# Altium schematic sheet Esq_Referencia_Fte_Simple.SchDoc: Referencia Fuente Simple Vcc/2
size A4; Date: 04/2014; Author: Roux, Federico G.; CompanyName: Universidad Favaloro; DrawnBy: Roux, Federico G.; Engineer: Dr. Craiem, Damian; Organization: Universidad Favaloro; DocumentName: Esq_Referencia_Fte_Simple; ProjectName: Acondicionamiento_Presion
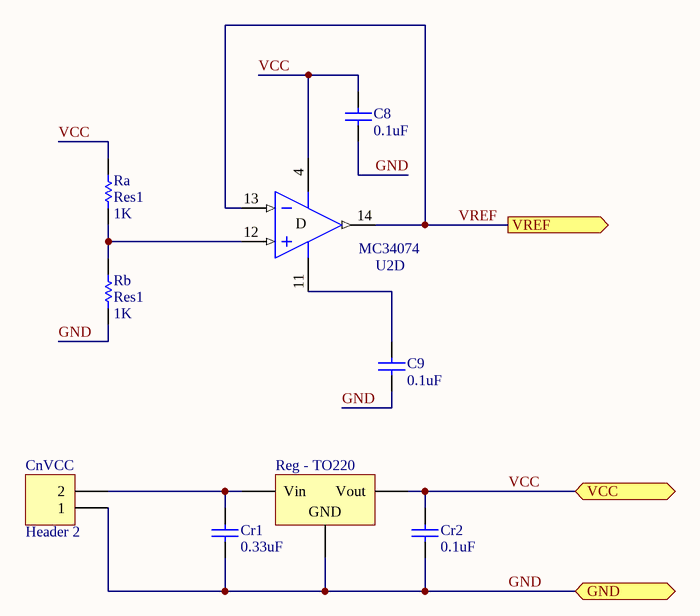
[diagram p0: Esq_Referencia_Fte_Simple.SchDoc]

## Parts
C8  value 0.1uF  [6-0805_M]  (hidden comment: Cap)
C9  value 0.1uF  [6-0805_M]  (hidden comment: Cap)
CnVCC  Header 2  [HDR1X2]
Cr1  value 0.33uF  [6-0805_M]  (hidden comment: Cap)
Cr2  value 0.1uF  [6-0805_M]  (hidden comment: Cap)
Ra  Res1  value 1K  [6-0805_L]
Rb  Res1  value 1K  [6-0805_L]
Reg_-_TO220  Volt Reg  [TO-220-AB]  (value not drawn)
U2  MC34074  [Q-14]  (part D of 4)

## Ports
GND, VCC, VREF (out)

## Nets
GND: C8.2 C9.2 CnVCC.1 Cr1.2 Cr2.2 Rb.1 Reg_-_TO220.2(GND) ; port GND
VCC: C8.1 Cr2.1 Ra.2 Reg_-_TO220.3(Vout) U2.4(V+) ; port VCC
VREF: U2.13(IN-) U2.14(OUT) ; port VREF
NetC9_1: C9.1 U2.11(V-)
NetCnVCC_2: CnVCC.2 Cr1.1 Reg_-_TO220.1(Vin)
NetRa_1: Ra.1 Rb.2 U2.12(IN+)

## Notes on the sheet
- (in symbol AD713BQ, part D) D

## Library data of the parts
C8 C9 Cr1 Cr2 = Cap: Capacitor; Published: 8-Jun-2000; LatestRevisionDate: 17-Jul-2002; LatestRevisionNote: Re-released for DXP Platform.; PackageReference: RAD-0.3; Publisher: Altium Limited; PackageDescription: Radial Cap, Thru-Hole; 2 Leads; 0.3 in Pin Spacing
CnVCC = Header 2: Header, 2-Pin; LatestRevisionDate: 17-Jul-2002; LatestRevisionNote: Re-released for DXP Platform.; Publisher: Altium Limited
Ra Rb = Res1: Resistor; Published: 8-Jun-2000; LatestRevisionDate: 17-Jul-2002; LatestRevisionNote: Re-released for DXP Platform.; PackageReference: AXIAL-0.3; Publisher: Altium Limited; PackageDescription: Axial Device, Thru-Hole; 2 Leads; 0.3 in Pin Spacing
Reg_-_TO220 = Volt Reg: Voltage Regulator; Published: 24-Mar-1999; LatestRevisionDate: 29-May-2009; LatestRevisionNote: IPC-7351 Footprint Added.; PackageReference: D2PAK; Publisher: Altium Limited; PackageDescription: 3-Pin Transistor Outline Package 2.54 mm Pitch, 15.1 mm Lead Span
U2 = AD713BQ: Quad Precision Low Cost High-Speed BiFET Operational Amplifier; Published: 8-Jun-2000; LatestRevisionDate: 04-Mar-2005; LatestRevisionNote: Stylized 3D Model Added.; DatasheetVersion: REV. B; PackageVersion: revB; PackageReference: Q-14; Publisher: Altium Limited; PackageDescription: DIP; 14 Leads; Row Spacing 7.62 mm; Pitch 2.54 mm; ComponentLink1Description: Manufacturer Link; ComponentLink1URL: http://www.analog.com/en/prod/0,,759_786_AD713%2C00.html; ComponentLink2Description: Datasheet; ComponentLink2URL: http://www.analog.com/UploadedFiles/Data_Sheets/70859332AD713_c.pdf